# Altium schematic sheet nguon.SchDoc
size A3
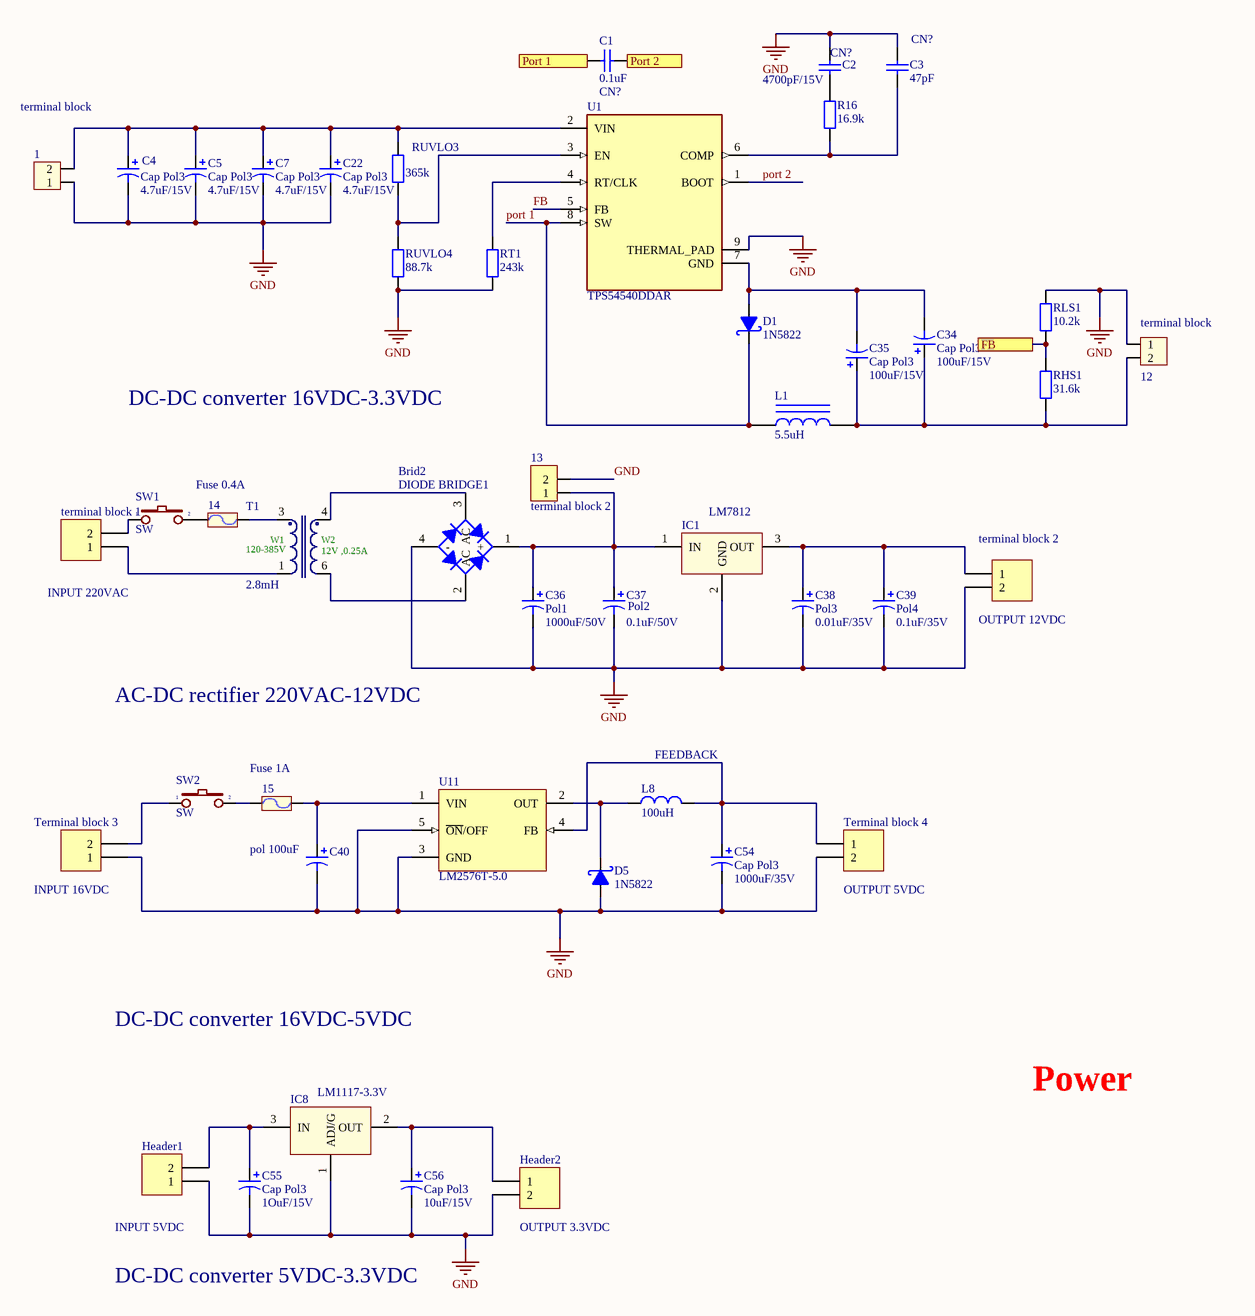
[diagram p0: nguon.SchDoc]

## Parts
1  terminal block  [HED2]
12  terminal block  [HED2]
13  terminal block 2  [HDR2]
14  Fuse 0.4A  [Fuse]
15  Fuse 1A  [Fuse]
Brid2  DIODE BRIDGE1  [CAU 5A]
C1  0.1uF  value CN?  [CNP]
C2  4700pF/15V  value CN?  [CNP]
C3  47pF  value CN?  [CNP]
C4  Cap Pol3  value 4.7uF/15V  [CP2/5]
C5  Cap Pol3  value 4.7uF/15V  [CP2/5]
C7  Cap Pol3  value 4.7uF/15V  [CP2/5]
C22  Cap Pol3  value 4.7uF/15V  [CP2/5]
C34  Cap Pol3  value 100uF/15V  [CP2/5]
C35  Cap Pol3  value 100uF/15V  [CP2/5]
C36  Pol1  value 1000uF/50V  [CP2/5]
C37  Pol2  value 0.1uF/50V  [CP2/5]
C38  Pol3  value 0.01uF/35V  [CP2/5]
C39  Pol4  value 0.1uF/35V  [CP2/5]
C40  pol 100uF  [C10mm]
C54  Cap Pol3  value 1000uF/35V  [CP2/5]
C55  Cap Pol3  value 1OuF/15V  [CP2/5]
C56  Cap Pol3  value 10uF/15V  [CP2/5]
D1  1N5822  [D5A]
D5  1N5822  [D5A]
Header1  Header 2  [HEDH]  (value not drawn)
Header2  Header 2  [HEDH]  (value not drawn)
IC1  LM7812  [QTO-220]
IC8  LM1117-3.3V  [SOT223-4N]
L1  value 5.5uH  [R1/2W]  (hidden comment: Inductor Iron)
L8  100uH  [L/0.4]
R16  16.9k  [R1/4W]
RHS1  31.6k  [R1/4W]
RLS1  10.2k  [R1/4W]
RT1  243k  [R1/4W]
RUVLO3  365k  [R1/4W]
RUVLO4  88.7k  [R1/4W]
SW1  SW  [SW2]
SW2  SW  [SW2]
T1  2.8mH  [EE13/7/4-Vertical/(EF12.6)]
terminal_block_1  Header 2  [HEDH]  (value not drawn)
terminal_block_2  Header 2  [HEDH]  (value not drawn)
Terminal_block_3  Header 2  [HEDH]  (value not drawn)
Terminal_block_4  Header 2  [HEDH]  (value not drawn)
U1  TPS54540DDAR  [CONV_TPS54540DDAR]
U11  LM2576T-5.0  [LM2576t]

## Ports
FB, Port 1, Port 2

## Nets
GND: 1.1 12.1 13.2 Brid2.4(-) C2.2 C3.2 C4.2 C5.2 C7.2 C22.2 C36.2 C37.2 C38.2 C39.2 C40.2 C54.2 C55.2 C56.2 D5.1(A) Header1.1 Header2.2 IC1.2(GND) IC8.1(ADJ/G) RLS1.2 RT1.1 RUVLO4.1 terminal_block_2.2 Terminal_block_3.1 Terminal_block_4.2 U1.9(THERMAL_PAD) U11.3(GND) U11.5(~{ON}/OFF)
FB: U1.5(FB)
FB: RHS1.2 RLS1.1 ; port FB  [a separate net that carries the same name]
port 1: D1.2(K) L1.1 U1.8(SW)
Port 1: C1.2 ; port Port 1  [a separate net that carries the same name]
port 2: U1.1(BOOT)
Port 2: C1.1 ; port Port 2  [a separate net that carries the same name]
Net1_2: 1.2 C4.1 C5.1 C7.1 C22.1 RUVLO3.2 U1.2(VIN)
Net12_2: 12.2 C34.1 C35.1 L1.2 RHS1.1
Net13_1: 13.1 Brid2.1(+) C36.1 C37.1 IC1.1(IN)
Net14_1: 14.1 SW1.2
Net14_2: 14.2 T1.3
Net15_1: 15.1 SW2.2
Net15_2: 15.2 C40.1 U11.1(VIN)
NetBrid2_2: Brid2.2(AC) T1.6
NetBrid2_3: Brid2.3(AC) T1.4
NetC2_1: C2.1 R16.2
NetC3_1: C3.1 R16.1 U1.6(COMP)
NetC34_2: C34.2 C35.2 D1.1(A) U1.7(GND)
NetC38_1: C38.1 C39.1 IC1.3(OUT) terminal_block_2.1
NetC54_1: C54.1 L8.2 Terminal_block_4.1 U11.4(FB)
NetC55_1: C55.1 Header1.2 IC8.3(IN)
NetC56_1: C56.1 Header2.1 IC8.2(OUT)
NetD5_2: D5.2(K) L8.1 U11.2(OUT)
NetRT1_2: RT1.2 U1.4(RT/CLK)
NetRUVLO3_1: RUVLO3.1 RUVLO4.2 U1.3(EN)
NetSW1_1: SW1.1 terminal_block_1.2
NetSW2_1: SW2.1 Terminal_block_3.2
NetT1_1: T1.1 terminal_block_1.1

## Notes on the sheet
- DC-DC converter 16VDC-3.3VDC
- (near terminal_block_1) INPUT 220VAC
- (near terminal_block_2) OUTPUT 12VDC
- AC-DC rectifier 220VAC-12VDC
- (near L8) FEEDBACK
- (near Terminal_block_3) INPUT 16VDC
- (near Terminal_block_4) OUTPUT 5VDC
- DC-DC converter 16VDC-5VDC
- Power
- (near Header1) INPUT 5VDC
- DC-DC converter 5VDC-3.3VDC
- (near Header2) OUTPUT 3.3VDC
- Title
- Size:
- Date:
- A3
- Number:
- Time:
- Revision:
- Sheet
- of
- File:
- (in symbol Tranf7) W1; W2; 120-385V; 12V ,0.25A

## Library data of the parts
1 12 = Hed2: Header 2 (Green); Value: Header 2
13 = Header2: Header IDC, 2 x 1 Pin Vertical 2.54mm Pitch (Non-Boxed, Male); Manufacturer: W¨¹rth Elektronik eiSos GmbH; partNo: 613002143121; ComponentLink1 Description: Manufacturer; ComponentLink2 Description: Datasheet; NoPins: 02; Created Date: 29 March 2013; ComponentLink1URL: http://www.we-online.com; ComponentLink2URL: http://katalog.we-online.de/em/datasheet/6130xx143121.pdf; Created by: Karrer Zheng
14 15 = Fuse: Designed by: VanDungEvn; Value: Fuse
C1-C3 = Cap Semi: Capacitor (Semiconductor SIM Model); Value: 104; LatestRevisionDate: 17-Jul-2002; LatestRevisionNote: Re-released for DXP Platform.; PackageReference: C1206; Publisher: Altium Limited
C4 C5 C7 C22 C34 C35 C54-C56 = Cap Pol3: Polarized Capacitor (Surface Mount); VALUE: C?; LatestRevisionDate: 17-Jul-2002; LatestRevisionNote: Re-released for DXP Platform.; PackageReference: C0805; Publisher: Altium Limited
C36-C39 = Cap Pol3_5: Polarized Capacitor (Surface Mount); VALUE: C?; LatestRevisionDate: 17-Jul-2002; LatestRevisionNote: Re-released for DXP Platform.; PackageReference: C0805; Publisher: Altium Limited
C40 = Cap Pol 12mm: Polarized Capacitor (Axial); Published: 8-Jun-2000; LatestRevisionDate: 17-Jul-2002; LatestRevisionNote: Re-released for DXP Platform.; PackageReference: POLAR0.8; Publisher: Altium Limited
D1 D5 = 1N5822: Schottky Rectifiers; Value: Diode c?m 1N5408
Header1 Header2 terminal_block_1 terminal_block_2 Terminal_block_3 Terminal_block_4 = Header 2: Header, 2-Pin; Manufacturer: Generic Components; Class: Connector; Value: Header 2
IC1 = LM78xx: On ap +, from + 5 to + 24VDC; Value: LM7805
IC8 = LM1117: Available in 1.8V, 2.5V, 2.85V, 3.3V, 5V, and  Adjustable Versions; Value: LM317
L1 = Inductor Iron_1: Magnetic-Core Inductor; Manufacturer: Generic Components; Class: Passive; Published: 1999; SubClass: Inductor
L8 = Inductor: Value: 150 mH
R16 RHS1 RLS1 RT1 RUVLO3 RUVLO4 = R1/4W: Resistor 1/4W; Value: R1/4W - 1K
SW1 SW2 = SW2: Switch button 2 pin; Value: SW chip 2 pin
T1 = Tranf7: Off-Line Transformer WE-UNIT , L=2.8mH; PartNo: 7491181012; Manufacturer: Würth Elektronik eiSos GmbH; Turns Ratio: 8.1:1; Input Voltage (AC): 85-265; Output Current (A): 0.5; Output Voltage (DC): 12; Inductance: 2.8mH; ComponentLink1Description: Manufacturer; ComponentLink1URL: http://www.we-online.de; Created by: Otto Christin; Created Date: OCT 2013; ComponentLink2Description: Datasheet; ComponentLink2URL: http://www.we-online.de/katalog/media/pdf/7491181012.pdf
U1 = TPS54540DDAR: 42 V, 5 A, Step-Down DC-DC Converter with Eco-Mode 8-SO PowerPAD -40 to 125; MF: Texas Instruments; SnapEDA_Link: https://www.snapeda.com/parts/TPS54540DDAR/Texas%20Instruments/view-part/454643/?ref=snap; Package: HSOIC-8 Texas Instruments; Check_prices: https://www.snapeda.com/parts/TPS54540DDAR/Texas%20Instruments/view-part/454643/?ref=eda; MP: TPS54540DDAR; Value: *; Digi-Key_Part_Number: 296-39422-1-ND; Purchase-URL: https://pricing.snapeda.com/search/part/TPS54540DDAR/?ref=eda
U11 = LM2576T-5.0: SIMPLE SWITCHER; 3A Step-Down Voltage Regulator; Manufacturer: National Semiconductor; PackageTopMarking: NSUZXYTT*LM2576T*-5.0 P+; PowerWise: N; FirstPublished: 4-Dec-2008; DatasheetVersion: Aug-2004; PackageVersion: revJ, Jan-1992; PackageReference: T05A; Publisher: Altium Limited; PackageDescription: TO-220, Molded, 5 Lead, Straight; CompType: Switcher; PartNumber: LM2576T-5.0; RoHS: O; PinCount: 5; DigiKeyPartNumber: LM2576T-5.0-ND; Code_JEDEC: TO-220-AB; ComponentLink1Description: LM2576 Datasheet; ComponentLink1URL: http://www.national.com/ds/LM/LM2576.pdf; ComponentLink2Description: LM2576 Web Page; ComponentLink2URL: http://www.national.com/pf/LM/LM2576.html; ComponentLink3Description: T05A Package Page; ComponentLink3URL: http://www.national.com/packaging/folders/t05a.html